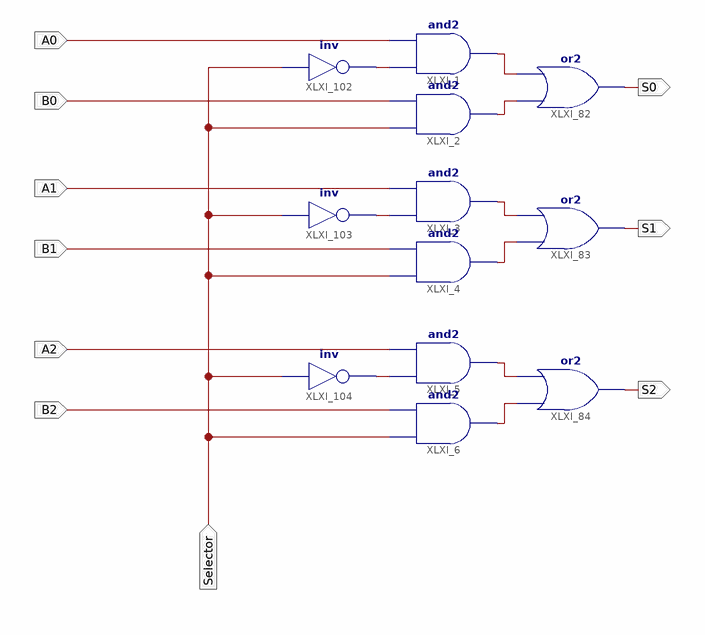
[diagram p0: schematic sheet 1]
// Xilinx ISE schematic MUX213.sch (spartan6) as structural Verilog: 12 symbols, 10 ports
module MUX213 (
  input  A0,
  input  B0,
  input  A1,
  input  B1,
  input  A2,
  input  B2,
  input  Selector,
  output S0,
  output S1,
  output S2
);

  wire XLXN_89, XLXN_90, XLXN_91, XLXN_92, XLXN_93, XLXN_94, XLXN_127, XLXN_128, XLXN_129;

  and XLXI_1 (XLXN_89, XLXN_127, A0);
  and XLXI_2 (XLXN_90, Selector, B0);
  and XLXI_3 (XLXN_91, XLXN_128, A1);
  and XLXI_4 (XLXN_92, Selector, B1);
  and XLXI_5 (XLXN_93, XLXN_129, A2);
  and XLXI_6 (XLXN_94, Selector, B2);
  or XLXI_82 (S0, XLXN_90, XLXN_89);
  or XLXI_83 (S1, XLXN_92, XLXN_91);
  or XLXI_84 (S2, XLXN_94, XLXN_93);
  not XLXI_102 (XLXN_127, Selector);
  not XLXI_103 (XLXN_128, Selector);
  not XLXI_104 (XLXN_129, Selector);
endmodule
